# EAGLE design ECGv2_Board (EAGLE 6.5.0)
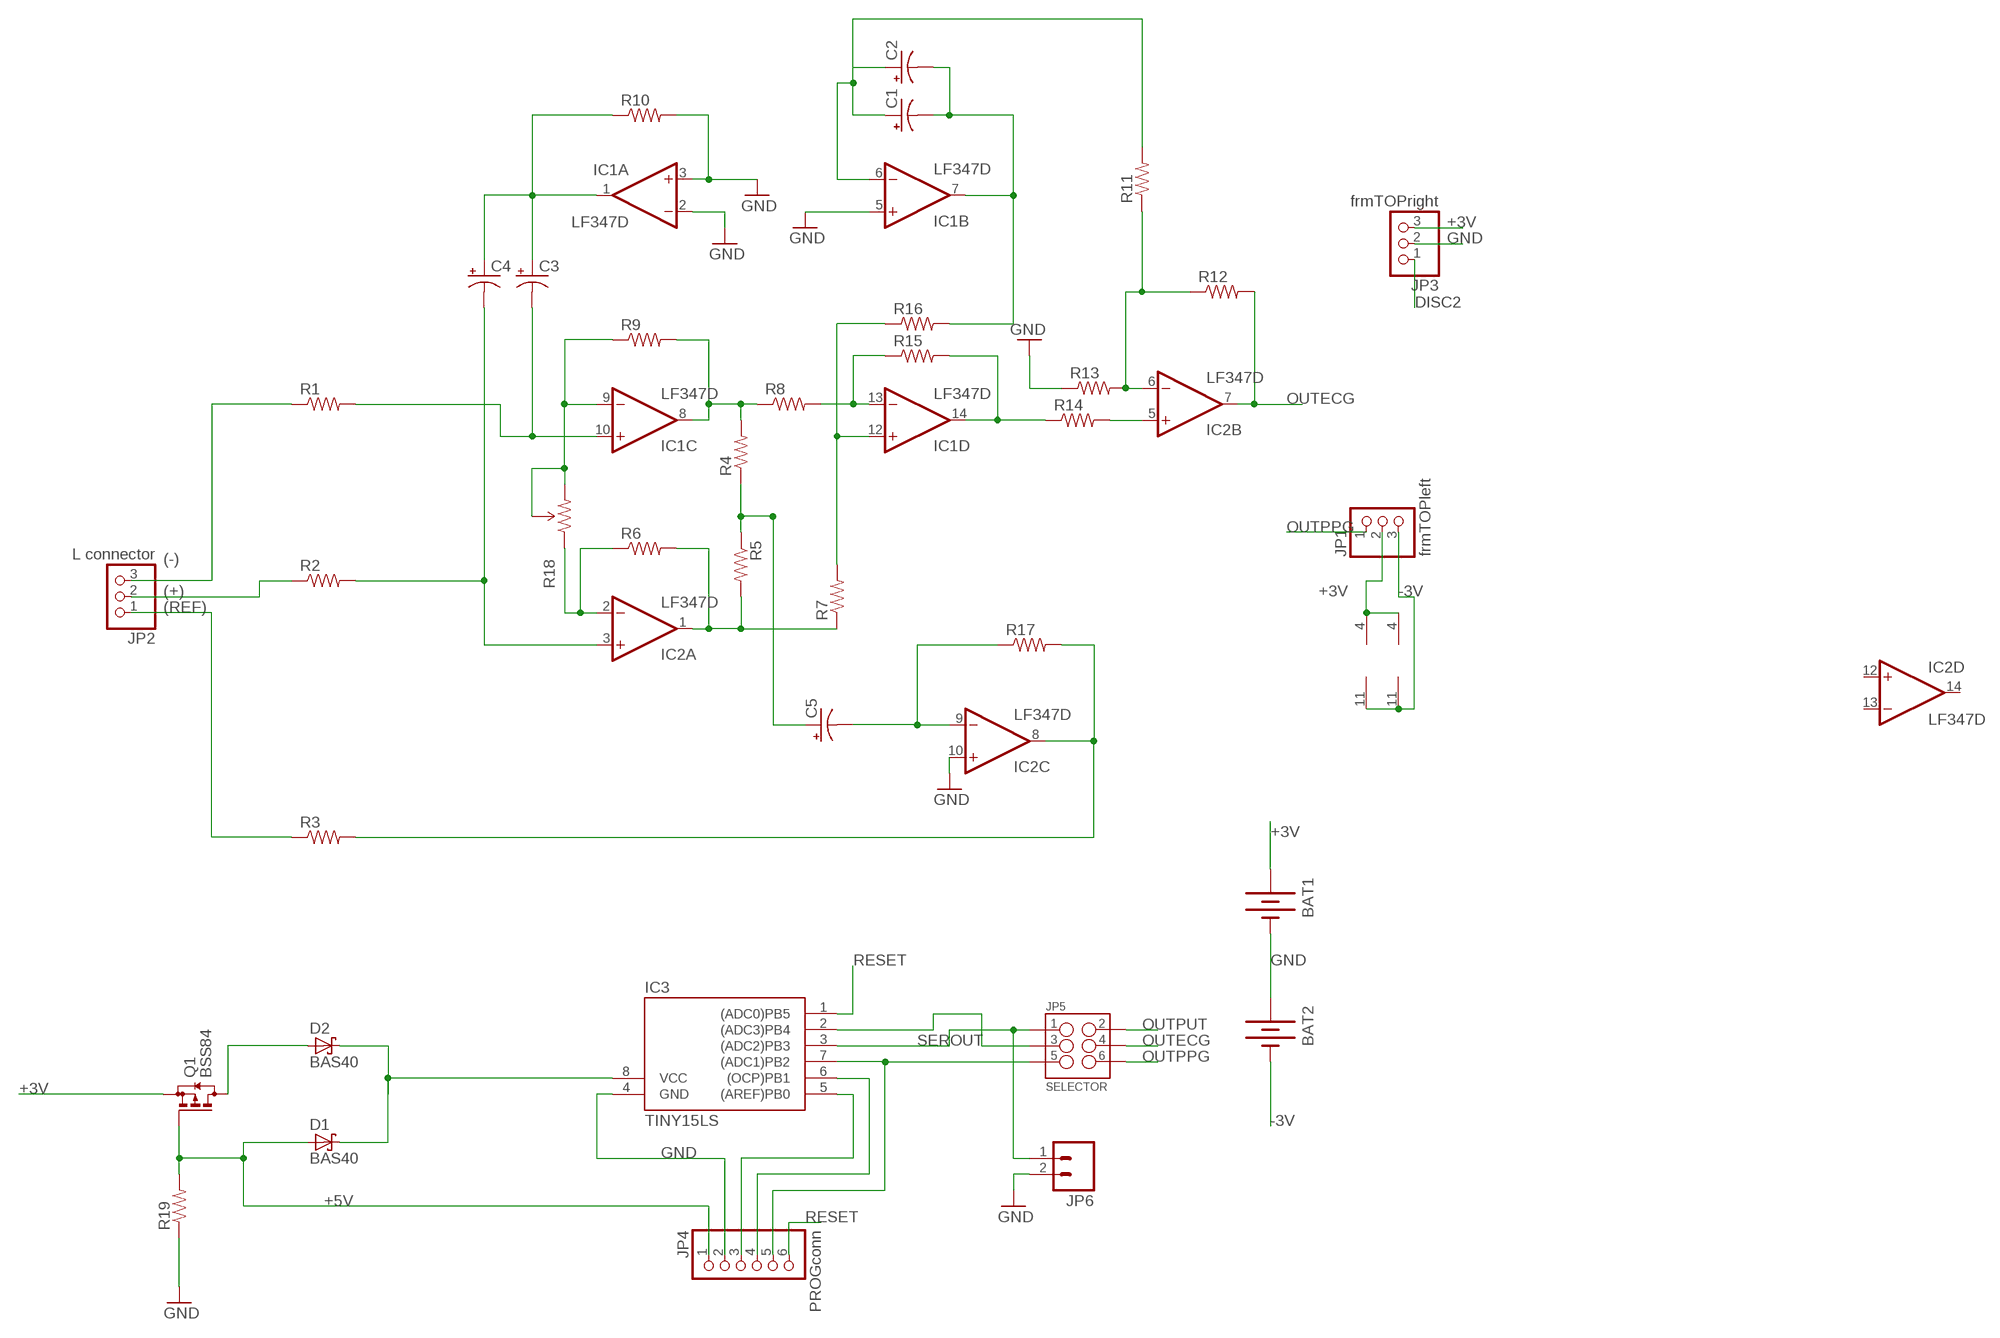
[diagram p0: schematic, sheet 1]

## Parts
BAT1  BATTERY245MM  [BATTCON_245MM]
BAT2  BATTERY245MM  [BATTCON_245MM]
C1  CAP_POL1206-KIT  [EIA3216-KIT]
C2  CAP_POL1206-KIT  [EIA3216-KIT]
C3  CAP_POL1206-KIT  [EIA3216-KIT]
C4  CAP_POL1206-KIT  [EIA3216-KIT]
C5  CAP_POL1206-KIT  [EIA3216-KIT]
D1  BAS40  [SOT23]
D2  BAS40  [SOT23]
IC1  LF347D  [SO14]
IC2  LF347D  [SO14]
IC3  TINY15LS  [SOIC8]
JP1  frmTOPleft  PINHD-1X3  [1X03]
JP2  L connector  PINHD-1X3  [1X03]
JP3  frmTOPright  PINHD-1X3  [1X03]
JP4  PROGconn  PINHD-1X6B  [1X06-BIG]
JP5  SELECTOR  M03X2FEMALE  [2X3]
JP6  M02PTH  [1X02]
Q1  BSS84  [SOT23]
R1  RESISTOR0402-RES  [0402-RES]
R2  RESISTOR0402-RES  [0402-RES]
R3  RESISTOR0402-RES  [0402-RES]
R4  RESISTOR0402-RES  [0402-RES]
R5  RESISTOR0402-RES  [0402-RES]
R6  RESISTOR0402-RES  [0402-RES]
R7  RESISTOR0402-RES  [0402-RES]
R8  RESISTOR0402-RES  [0402-RES]
R9  RESISTOR0402-RES  [0402-RES]
R10  RESISTOR0402-RES  [0402-RES]
R11  RESISTOR0402-RES  [0402-RES]
R12  RESISTOR0402-RES  [0402-RES]
R13  RESISTOR0402-RES  [0402-RES]
R14  RESISTOR0402-RES  [0402-RES]
R15  RESISTOR0402-RES  [0402-RES]
R16  RESISTOR0402-RES  [0402-RES]
R17  RESISTOR0402-RES  [0402-RES]
R18  TRIMPOT3362U-2  [3362U-2]
R19  RESISTOR0402-RES  [0402-RES]

## Nets
(+): JP2.2 R2.1
(-): JP2.3 R1.1
(REF): JP2.1 R3.1
+3V: BAT1.1(+) BAT1.3(+) IC1.4(P:V+) IC2.4(P:V+) JP1.2 JP3.3 Q1.2(S)
+5V: D1.1(A) JP4.1 Q1.1(G) R19.2
-3V: BAT2.2(-) IC1.11(P:V-) IC2.11(P:V-) JP1.3
DISC2: JP3.1
GND: BAT1.2(-) BAT2.1(+) BAT2.3(+) IC1.2(A:-IN) IC1.3(A:+IN) IC1.5(B:+IN) IC2.10(C:+IN) IC3.4(GND) JP3.2 JP4.2 JP6.2 R10.2 R13.1 R19.1
N$1: C1.C(-) C2.C(-) IC1.7(B:OUT) R16.2
N$2: C1.A(+) C2.A(+) IC1.6(B:-IN) R11.2
N$3: IC1.9(C:-IN) R9.1 R18.2(WIPER) R18.3(CW)
N$4: D2.1(A) Q1.3(D)
N$5: IC2.6(B:-IN) R11.1 R12.1 R13.2
N$6: IC1.14(D:OUT) R14.1 R15.2
N$7: IC1.13(D:-IN) R8.2 R15.1
N$8: IC1.12(D:+IN) R7.2 R16.1
N$9: IC2.1(A:OUT) R5.2 R6.2 R7.1
N$10: IC1.8(C:OUT) R4.2 R8.1 R9.2
N$12: IC2.2(A:-IN) R6.1 R18.1(CCW)
N$13: C5.A(+) R4.1 R5.1
N$14: C5.C(-) IC2.9(C:-IN) R17.1
N$15: IC2.8(C:OUT) R3.2 R17.2
N$16: C3.A(+) C4.A(+) IC1.1(A:OUT) R10.1
N$17: IC2.5(B:+IN) R14.2
N$18: C4.C(-) IC2.3(A:+IN) R2.2
N$19: C3.C(-) IC1.10(C:+IN) R1.2
N$23: IC3.5((AREF)PB0) JP4.3
N$24: IC3.6((OCP)PB1) JP4.4
N$25: IC3.7((ADC1)PB2) JP4.5 JP5.5
N$26: D1.3(C) D2.3(C) IC3.8(VCC)
N$28: IC3.2((ADC3)PB4) JP5.3
OUTECG: IC2.7(B:OUT) JP5.4 R12.2
OUTPPG: JP1.1 JP5.6
OUTPUT: JP5.2
RESET: IC3.1((ADC0)PB5) JP4.6
SEROUT: IC3.3((ADC2)PB3) JP5.1 JP6.1
Unconnected: IC2.12(D:+IN) IC2.13(D:-IN) IC2.14(D:OUT)

## Library data of the parts
BAT1 BAT2 = SparkFun-Electromechanical:BATTERY: Battery Holders Various common sizes : AA, AAA, 18650 (PRT-12895), 20mm coin cell and 12mm coin cell. 20MM_4LEGS, BATT-10373
C1-C5 = SparkFun-Passives:CAP_POL: Capacitor Polarized These are standard SMD and PTH capacitors. Normally 10uF, 47uF, and 100uF in electrolytic and tantalum varieties. Always verify the external diameter of the through hole cap, it varies with capacity, voltage, and manufacturer. The EIA devices should be standard.
D1 D2 = diode:BAS40: Silicon Schottky Diodes General-purpose diode for high-speed switching
IC1 IC2 = linear:LF347: OP AMP
IC3 = atmel:TINY15L: MICROCONTROLLER 2.7 V 1 Kbytes FLASH 64 bytes EEPROM 4-channel 10 bit ADC; OC_FARNELL: unknown; OC_NEWARK: unknown
JP1-JP3 = adafruit:PINHD-1X3: PIN HEADER
JP4 = adafruit:PINHD-1X6: PIN HEADER
JP5 = SparkFun-Connectors:M03X2: 2x3 .1" header. Shrouded, with keying- CONN-10681 SMT- CONN-11415 Pogo pins- HW-11044; PROD_ID: CONN-11566; VALUE: FEMALE 2x3
JP6 = SparkFun-Connectors:M02: Standard 2-pin 0.1" header. Use with - straight break away headers ( PRT-00116) - right angle break away headers (PRT-00553) - swiss pins (PRT-00743) - machine pins (PRT-00117) - female headers (PRT-00115) Molex polarized connector foot print use with: PRT-08233 with associated crimp pins and housings. 2.54_SCREWTERM for use with PRT-10571. 3.5mm Screw Terminal footprints for PRT-08084 5mm Screw Terminal footprints for use with PRT-08432
Q1 = transistor-small-signal:BSS84: P-CHANNEL MOS FET
R1-R17 R19 = SparkFun-Passives:RESISTOR: Resistor Basic schematic elements and footprints for 0603, 1206, and PTH resistors.
R18 = SparkFun-Electromechanical:TRIMPOT: Various small potentiometers for "set-and-forget" applications

## Board
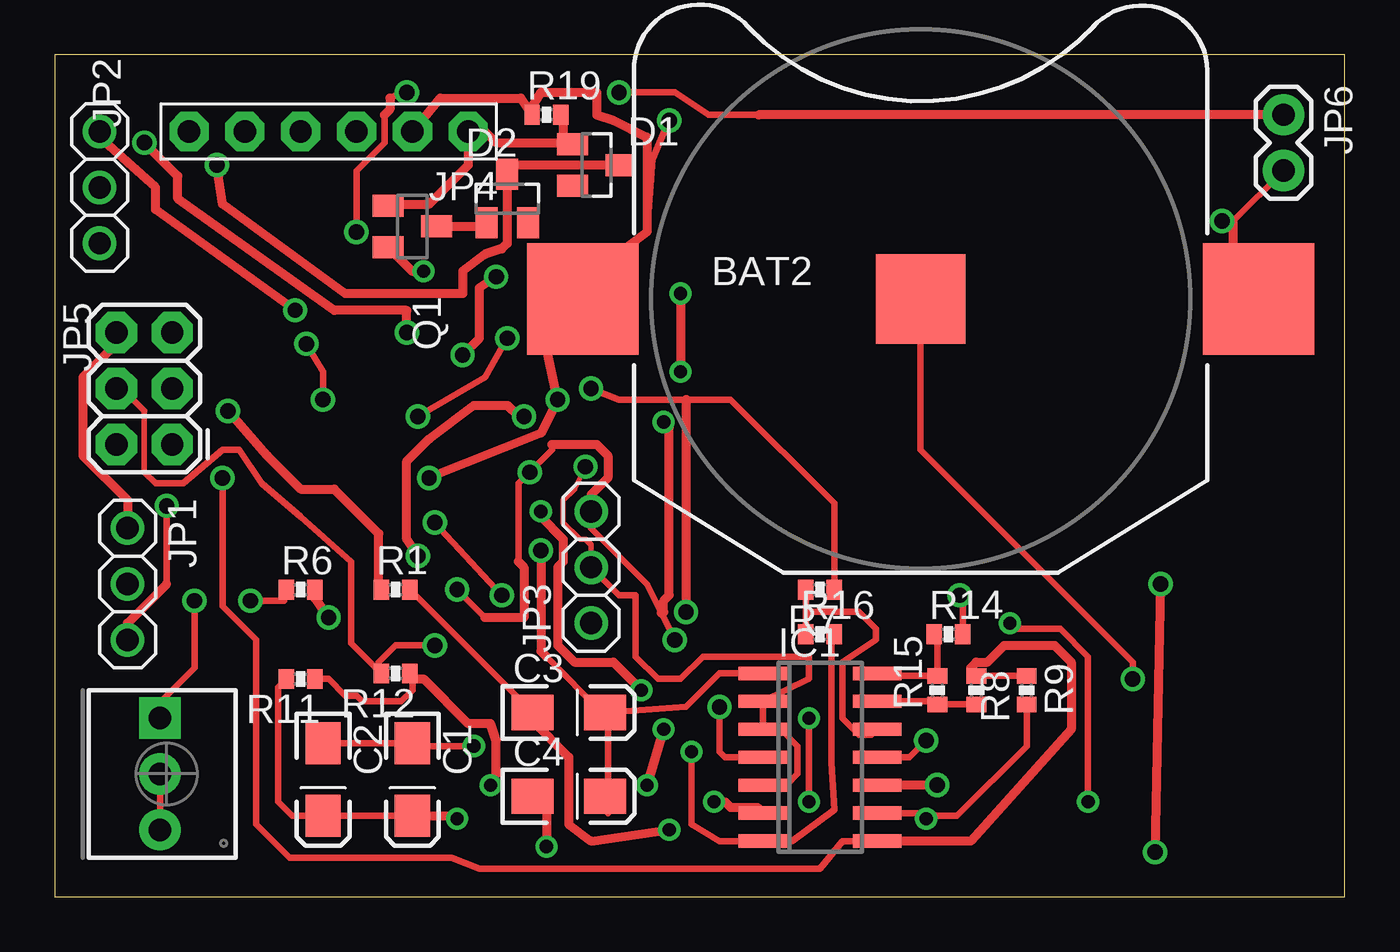
[diagram p1: board, top side]
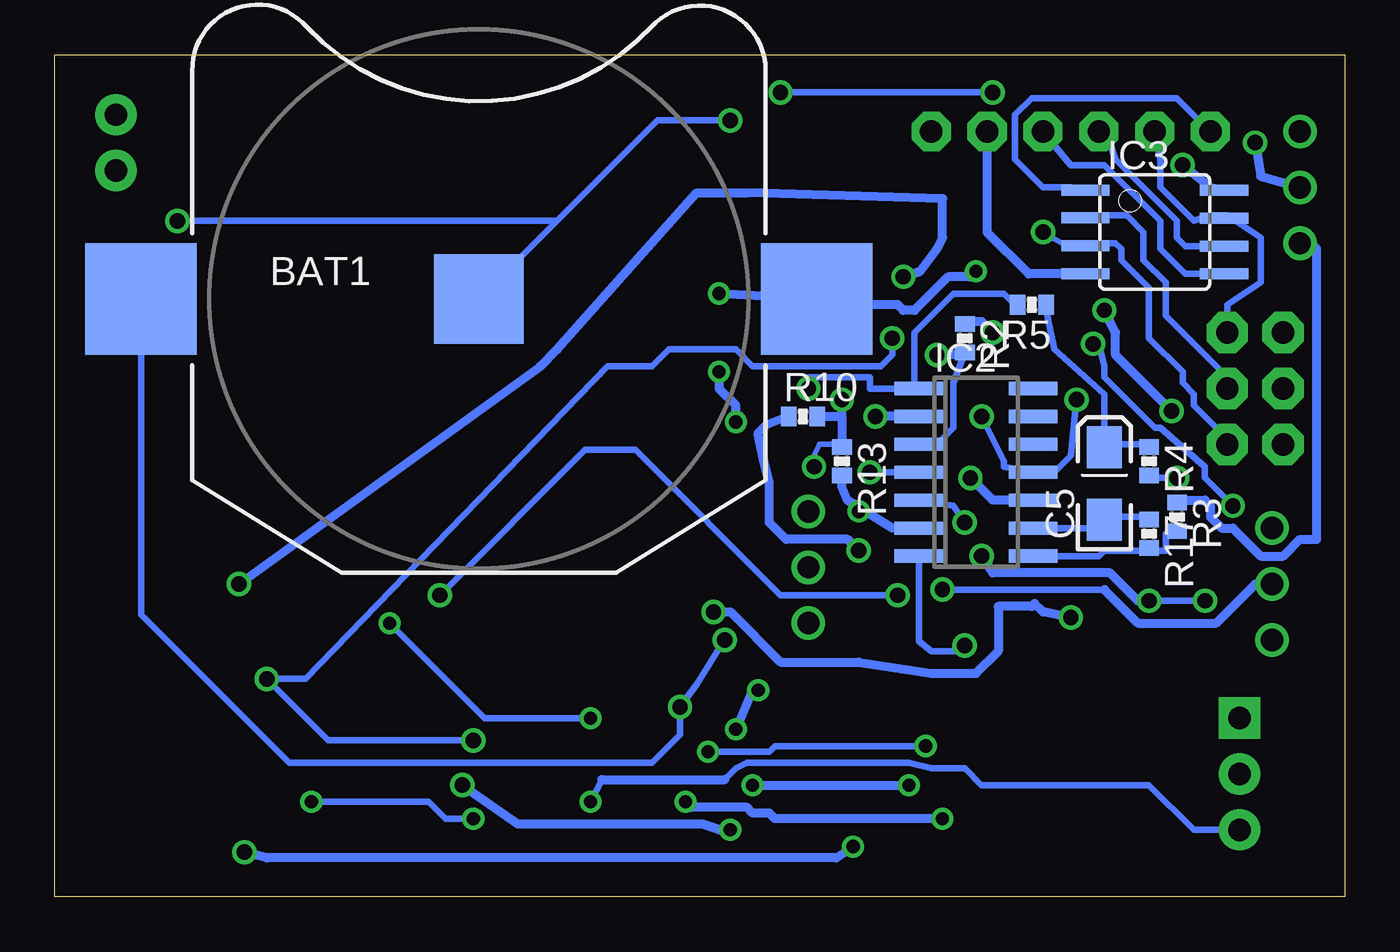
[diagram p2: board, bottom side, seen from below]

Size 58.65 x 38.28 mm. Coordinates in mm from the lower left corner, seen from the top.
Outline: 0,0 58.65,0 58.65,38.28 0,38.28 0,0
Copper layers (1*16): Top 0.035mm / dielectric 1.5mm / Bottom 0.035mm
Design rules "default *": minimum track width 10mil, minimum drill 20mil, track to track 8mil, track to pad 8mil, pad to pad 8mil, via to via 8mil, smd to smd 8mil, copper to edge 40mil, drill to drill 8mil, minimum pad ring 10mil, minimum via ring 8mil, stop-mask expansion 4mil, vias tented up to drill 0mil, thermal gap 10mil

### Footprints (pad centres in the part's own frame; a part is rotated, then mirrored left to right if it is on the bottom)
BATTCON_245MM = smd 5.08 x 5.08: 1 -15.367,0; 3 15.367,0 | smd 4.064 x 4.064: 2 0,0
EIA3216-KIT = smd 1.9 x 1.6: A 1.65,0; C -1.65,0
SOT23 = smd 1 x 1.4: 1 -0.95,-1.1; 2 0.95,-1.1; 3 0,1.1
SO14 = smd 0.6 x 2.2: 1 -3.81,-2.6; 2 -2.54,-2.6; 3 -1.27,-2.6; 4 0,-2.6; 5 1.27,-2.6; 6 2.54,-2.6; 7 3.81,-2.6; 8 3.81,2.6; 9 2.54,2.6; 10 1.27,2.6; 11 0,2.6; 12 -1.27,2.6; 13 -2.54,2.6; 14 -3.81,2.6
SOIC8 = smd 0.5 x 2.2: 1 -1.905,-3.154; 2 -0.645,-3.154; 3 0.625,-3.154; 4 1.895,-3.154; 5 1.905,3.154; 6 0.635,3.154; 7 -0.635,3.154; 8 -1.905,3.154
1X03 = drill 1.016: 1 -2.54,0; 2 0,0; 3 2.54,0
1X06-BIG = drill 1.016 pad 1.778 octagon: 1 -6.35,0; 2 -3.81,0; 3 -1.27,0; 4 1.27,0; 5 3.81,0; 6 6.35,0
2X3 = drill 1.016 pad 1.88 octagon: 1 0,0; 2 0,2.54; 3 2.54,0; 4 2.54,2.54; 5 5.08,0; 6 5.08,2.54
1X02 = drill 1.016 pad 1.88: 1 0,0; 2 2.54,0
0402-RES = smd 0.7 x 0.9: 1 -0.65,0; 2 0.65,0
3362U-2 = drill 1.016 pad 1.88 square: 1 -2.54,-0.305 | drill 1.016 pad 1.88: 2 0,-0.305; 3 2.54,-0.305

### Placement (x,y rotation side)
BAT1  39.37,27.18 0 bottom
BAT2  39.37,27.18 0 top
C1  16.26,5.33 270 top
C2  12.19,5.33 270 top
C3  23.37,8.38 0 top
C4  23.37,4.57 0 top
C5  10.92,18.8 90 bottom
D1  24.64,33.27 270 top
D2  20.57,31.75 0 top
IC1  34.8,6.35 270 top
IC2  16.76,19.3 270 bottom
IC3  8.64,30.23 270 bottom
JP1  3.3,14.22 270 top
JP2  2.03,32.26 90 top
JP3  24.38,14.99 90 top
JP4  12.45,34.8 180 top
JP5  5.33,20.57 90 top
JP6  55.88,35.56 270 top
Q1  16.26,30.48 270 top
R1  15.49,13.97 0 top
R2  17.27,25.4 270 bottom
R3  7.62,17.27 270 bottom
R4  8.89,19.81 270 bottom
R5  14.22,26.92 180 bottom
R6  11.18,13.97 0 top
R7  34.8,13.97 180 top
R8  41.91,9.4 270 top
R9  44.2,9.4 90 top
R10  24.64,21.84 0 bottom
R11  11.18,9.91 180 top
R12  15.49,10.16 180 top
R13  22.86,19.81 270 bottom
R14  40.64,11.94 0 top
R15  40.13,9.4 90 top
R16  34.8,11.94 0 top
R17  8.89,16.51 270 bottom
R18  5.08,5.59 270 top
R19  22.35,35.56 0 top

### Tracks (layer width: path | path; a pad name or v marks a point on that pad's centre or on a via)
(+)  (via drill 0.7 pad 0.81)
  Top 0.406: v4.06,34.29 5.59,32.77 5.59,31.75 12.7,26.67 16,26.67 v16,25.65
  Bottom 0.406: JP2.2 3.81,32.77 v4.06,34.29 | v16,25.65 16.51,26.16 17.27,26.16 R2.1
(-)  (via drill 0.7 pad 0.81)
  Top 0.406: R1.1 14.73,13.97 14.73,16.51 12.7,18.54 11.18,18.54 9.65,20.07 v7.87,22.1 | v10.92,26.67 4.57,31.24 4.57,32.26 2.03,34.54 JP2.3
  Bottom 0.406: v7.87,22.1 10.41,24.64 10.41,25.65 v10.92,26.67
(REF)
  Bottom 0.406: JP2.1 1.52,29.72 1.27,29.46 1.27,16.26 2.03,16.26 2.79,15.49 3.81,15.49 5.08,16.76 5.59,16.76 6.1,17.27 6.1,17.78 6.35,18.03 7.62,18.03 R3.1
+3V  (via drill 0.6, 0.7 pad 0.41, 0.7 pad 0.61)
  Top 0.305: JP3.3 24.38,16.76 26.92,14.22 27.58,12.9 v28.19,11.68 | v30.23,8.64 30.23,6.6 30.48,6.35 IC1.4 | 22.61,20.57 22.61,20.32 v21.59,19.3 21.08,18.8 21.08,15.24 | v18.29,13.97 19.56,12.7
  Top 0.406: 19.56,12.7 21.34,12.7 21.34,14.99 21.08,15.24 | JP3.3 24.38,18.29 25.15,19.05 25.15,20.07 24.64,20.57 22.61,20.57 | Q1.2 16.24,28.45 v16.76,28.45 | v28.45,27.43 v28.45,23.88 | v27.69,21.59 27.94,21.34 27.94,13.72 27.69,13.46 27.69,12.95 27.58,12.9
  Bottom 0.305: v28.19,11.68 29.46,9.65 v30.23,8.64 30.23,7.37 31.5,6.1 48.01,6.1 54.74,12.83 BAT1.1 | IC2.4 v21.59,19.3 | 10.92,13.97 v18.29,13.97
  Bottom 0.406: JP1.2 4.06,14.22 5.84,12.45 9.4,12.45 10.92,13.97 | v16.76,28.45 17.02,28.19 18.03,28.19 19.56,26.67 20.07,26.67 20.32,26.92 24,26.92 BAT1.3 v28.45,27.43 | v28.45,23.88 28.45,23.11 27.69,22.35 v27.69,21.59
+5V
  Top 0.406: Q1.1 15.24,31.5 17.02,31.5 18.8,33.27 JP4.1 19.56,34.8 20.07,34.29 23.47,34.29 D1.1 23.37,34.29 23.11,34.29 23.11,35.56 R19.2
-3V  (via drill 0.7 pad 0.41, 0.7 pad 0.61)
  Top 0.305: BAT2.2 39.37,20.32 49.02,10.67 v49.02,9.91 | IC1.11 38.86,6.35 v39.62,7.11 | v11.43,25.15 12.19,23.88 v12.19,22.61 | v20.57,25.4 19.56,23.62 v16.51,21.84 | v5.08,17.78 5.08,14.22
  Top 0.406: JP1.3 3.3,12.45 5.08,14.22
  Bottom 0.305: v39.62,7.11 46.23,7.11 v49.02,9.91 47.24,9.91 33.53,24.13 31.5,24.13 30.73,24.89 27.69,24.89 26.92,24.13 21.08,24.13 20.57,24.64 v20.57,25.4 | v11.43,25.15 11.18,25.15 10.92,24.13 10.92,23.62 8.64,21.34 8.38,21.34 6.35,19.56 6.35,19.05 v5.08,17.78 | v12.19,22.61 12.45,20.07 13.21,19.3 IC2.11 15.49,19.56 15.49,19.81 v16.51,21.84
GND  (via drill 0.7 pad 0.41, 0.7 pad 0.61, 0.7 pad 0.81)
  Top 0.254: v24.13,19.56 23.62,18.54 23.11,18.03 23.11,17.02 23.88,16.26 24.13,16.26 24.38,16 JP3.2
  Top 0.305: JP3.2 25.65,13.72 26.42,13.72 26.42,10.92 27.43,9.91 28.45,9.91 29.46,10.92 34.29,10.92 34.29,9.91 IC1.2 IC1.3 33.02,7.62 33.78,6.86 33.78,5.59 33.27,5.08 IC1.5 | 26.92,30.23 27.18,33.53 v27.94,35.31 | 53.59,30.73 JP6.2
  Top 0.406: JP4.2 17.53,36.32 21.19,36.32 R19.1 21.7,35.93 22.1,36.58 24.64,36.58 24.64,35.56 25.4,35.31 26.92,34.54 26.92,30.23 22.86,27.18 22.86,27.05 23.07,27.07 | 23.07,27.07 BAT2.1 | 23.07,27.07 22.1,26.1 v22.86,22.61 22.1,21.08 v17.02,19.05 | BAT2.3 53.85,27.18 53.59,27.43 53.59,30.73 v53.09,30.73
  Bottom 0.254: v24.13,19.56 24.38,19.56 23.88,20.57 22.61,20.57 R13.1
  Bottom 0.305: v27.94,35.31 31.24,35.31 35.81,30.73 | 35.81,30.73 BAT1.2 | 35.81,30.73 v53.09,30.73
  Bottom 0.406: R10.2 22.86,21.84 | 22.86,21.84 R13.1 | 22.86,21.84 v22.86,22.61 | IC2.10 16,18.03 v17.02,19.05 | JP4.2 16.26,30.23 14.36,28.33 IC3.4
N$1  (via drill 0.6 pad 0.41)
  Top 0.305: R16.2 35.31,11.94 35.31,6.1 35.45,3.95 33.53,2.54 IC1.7 30.23,2.54 28.96,3.3 v28.96,6.6 | C2.C C1.C 16.38,6.86 v19.05,6.86
  Bottom 0.305: v28.96,6.6 26.16,6.6 25.91,6.86 v19.05,6.86
N$2  (via drill 0.6)
  Top 0.305: C1.A C2.A 10.79,3.68 10.16,4.32 10.16,9.54 R11.2
  Top 0.406: C1.A 18.16,3.68 v18.29,3.56 | v29.97,4.32 30.48,4.32 30.73,4.06 31.94,4.06 IC1.6
  Bottom 0.406: v18.29,3.56 25.91,3.56 26.16,3.81 26.92,3.81 27.18,4.06 29.72,4.06 v29.97,4.32
N$3  (via drill 0.6 pad 0.41)
  Top 0.305: v46.99,4.32 46.99,10.92 45.72,12.19 43.43,12.19 v43.43,12.45 | v34.29,4.32 v34.29,8.13 | IC1.9 39.37,3.81 v39.62,3.56 39.75,3.68 41.02,3.68 44.2,6.86 R9.1 | R18.3 R18.2
  Bottom 0.305: v46.99,4.32 41.66,4.32 40.89,3.56 v39.62,3.56 | v43.43,12.45 39.12,8.13 v34.29,8.13 | 33.78,5.33 v34.29,4.32 | 28.19,5.33 27.69,5.84 27.18,6.1 19.81,6.1 18.8,5.84 17.27,5.84 16.51,5.08 8.89,5.08 6.86,3.05 R18.3
  Bottom 0.406: 33.78,5.33 28.19,5.33
N$4
  Top 0.406: Q1.3 19.45,30.48 D2.1
N$5  (via drill 0.6, 0.6 pad 0.41)
  Top 0.305: R11.1 12.45,9.91 13.21,9.14 13.72,9.14 13.97,8.89 15.75,8.89 16.26,9.4 16.26,9.79 R12.1
  Top 0.406: R12.1 16.26,9.91 16.76,9.91 18.8,7.87 19.81,7.87 20.07,7.11 20.07,5.59 v19.81,5.08 | v27.69,7.62 v26.92,5.08 | v26.67,9.4 25.4,10.67 23.62,10.67 22.86,11.43 22.86,14.99 23.11,15.24 23.11,16.26 22.1,17.27 v22.1,17.53
  Bottom 0.406: IC2.6 20.57,16.76 22.01,17.66 | 22.01,17.66 22.61,18.03 22.86,18.65 R13.2 | v26.92,5.08 v19.81,5.08 | v27.69,7.62 26.92,9.4 v26.67,9.4 | v22.1,17.53 22.01,17.66
N$6
  Top 0.305: IC1.14 37.51,10.05 R15.2 40.13,11.8 R14.1
N$7
  Top 0.305: IC1.13 39.99,8.89 R15.1 R8.2
N$8
  Top 0.305: R7.2 R16.1 34.15,12.81 34.29,12.95 36.58,12.95 37.34,12.19 37.34,11.68 35.81,10.67 35.81,8.13 36.58,7.37 37.14,7.37 IC1.12
N$9  (via drill 0.7 pad 0.61, 0.7 pad 0.81)
  Top 0.305: R7.1 35.45,17.89 30.73,22.61 28.7,22.61 25.65,22.61 v24.38,23.11
  Top 0.406: R6.2 11.83,13.57 v12.45,12.7 | 28.7,22.61 v28.7,12.95
  Bottom 0.305: R5.2 14.99,26.92 15.49,27.43 17.78,27.43 19.56,25.65 19.56,23.31 IC2.1 21.59,23.11 21.59,23.62 24.38,23.62 v24.38,23.11
  Bottom 0.406: v12.45,12.7 13.72,12.95 14.1,13.34 14.22,13.21 15.75,13.21 15.75,11.18 16.76,10.16 18.8,10.16 22.1,10.67 25.65,10.67 27.94,12.95 v28.7,12.95
N$10  (via drill 0.7 pad 0.61)
  Top 0.305: R9.2 R8.1 41.66,10.41 | IC1.8 35.81,2.54 34.8,1.27 19.3,1.27 18.03,1.78 10.67,1.78 9.14,3.3 9.14,11.68 7.62,13.21 v7.62,19.05
  Top 0.406: R8.1 41.91,10.16 41.66,10.41 41.91,10.67 42.42,10.67 43.18,11.43 45.47,11.43 46.23,10.67 46.23,7.62 41.66,2.54 IC1.8
  Bottom 0.305: v7.62,19.05 8.89,19.05 R4.2
N$12  (via drill 0.7 pad 0.61, 0.7 pad 0.81)
  Top 0.305: v6.35,13.46 6.35,10.41 4.83,8.89 4.83,8.13 R18.1 | v8.89,13.46 10.41,13.46 10.41,13.97 R6.1
  Top 0.406: v16.51,15.49 16,16.26 16,19.81 17.02,20.83 19.05,22.35 20.57,22.35 21.08,21.84 v21.34,21.84
  Bottom 0.305: v6.35,13.46 v8.89,13.46
  Bottom 0.406: v16.51,15.49 16,14.73 10.67,14.73 9.4,13.46 v8.89,13.46 | IC2.2 v21.34,21.84
N$13
  Bottom 0.305: 10.92,20.57 8.89,20.57 R4.1 | 10.92,20.57 10.92,22.86 13.21,24.89 13.46,26.16 R5.1 | 10.92,20.57 C5.A
N$14
  Bottom 0.305: R17.1 8.89,17.27 11.18,17.27 C5.C 11.18,16.76 IC2.9
N$15
  Bottom 0.305: 8.89,15.75 8.13,15.75 8.13,16.51 7.62,16.51 R3.2 | 8.89,15.75 10.92,15.75 11.18,15.49 IC2.8 | 8.89,15.75 R17.2
N$16  (via drill 0.7 pad 0.81)
  Top 0.305: C4.A 25.15,3.81 25.15,7.87 C3.A | C3.A 28.7,8.64 30.23,10.16 IC1.1 | C3.A 24.89,8.38 22.35,10.92
  Top 0.406: v22.1,15.75 22.1,11.18 22.35,10.92
  Bottom 0.406: R10.1 26.3,21.45 26.67,21.08 26.42,19.81 26.16,18.8 26.16,17.02 25.4,16.26 22.61,16.26 v22.1,15.75
N$17  (via drill 0.7 pad 0.61)
  Top 0.305: R14.2 41.29,13.57 v41.15,13.72 | v17.27,17.02 v20.32,13.72
  Bottom 0.305: v41.15,13.72 34.54,20.32 32.26,20.32 25.65,13.72 v20.32,13.72 | v17.27,17.02 17.78,17.78 IC2.5
N$18  (via drill 0.6 pad 0.41, 0.7 pad 0.81)
  Top 0.406: v20.07,28.19 19.3,27.69 19.3,25.4 v18.54,24.64 | v50.04,2.03 v50.29,14.22 | v22.35,2.29 22.35,4.57 C4.C
  Bottom 0.305: R2.2 17.78,23.37 17.78,21.34 18.54,20.57 IC2.3
  Bottom 0.406: v20.07,28.19 19.3,28.45 18.54,29.46 18.29,29.97 18.29,31.75 27.18,32 29.46,32 35.81,24.89 36.58,24.13 v50.29,14.22 | v18.54,24.64 17.27,24.64 R2.2 | v50.04,2.03 49.02,1.78 23.11,1.78 v22.35,2.29
N$19  (via drill 0.6 pad 0.41, 0.7 pad 0.41)
  Top 0.305: C3.C R1.2
  Top 0.406: C3.C 21.72,8 23.37,6.35 23.37,3.3 24.38,2.54 v27.94,3.05 | v40.13,5.08 IC1.10
  Bottom 0.406: v27.94,3.05 28.45,3.05 29.21,3.3 37.59,3.3 v40.13,5.08
N$23
  Bottom 0.305: IC3.5 7.24,28.32 8.38,29.46 8.38,30.73 10.92,33.27 12.45,33.27 JP4.3
N$24
  Bottom 0.305: IC3.6 7.24,29.59 7.62,29.97 7.62,30.73 10.41,33.53 10.67,34.29 JP4.4
N$25
  Bottom 0.305: JP4.5 8.38,33.53 8.38,32.26 6.86,30.73 6.12,30.99 | 6.12,30.99 IC3.7 | JP5.5 5.33,26.92 3.81,27.94 3.81,29.97 5.33,30.99 6.12,30.99
N$26  (via drill 0.7 pad 0.81)
  Top 0.406: v7.37,33.27 7.62,31.5 13.21,27.43 18.54,27.43 18.54,28.45 19.56,29.21 20.32,29.46 20.57,29.72 D2.3 20.57,33.27 D1.3
  Bottom 0.406: 6.1,32.26 6.35,32.26 | v7.37,33.27 6.1,32.26 | 6.1,32.26 IC3.8
N$28
  Bottom 0.305: JP5.3 5.33,23.62 8.13,26.42 8.13,27.94 9.14,28.96 9.14,30.23 9.91,30.99 12.18,30.99 IC3.2
OUTECG  (via drill 0.7 pad 0.61)
  Top 0.254: 4.06,22.1 4.06,19.3
  Top 0.305: v17.27,11.43 15.49,11.43 14.73,10.67 14.73,10.27 R12.2 13.46,11.54 13.46,15.24 11.18,17.27 9.4,18.8 8.38,20.32 7.62,20.32 5.84,18.8 4.57,18.8 4.06,19.3 | JP5.4 3.05,23.11 4.06,22.1
  Bottom 0.305: IC2.7 19.36,11.62 18.8,11.18 17.53,11.18 v17.27,11.43
OUTPPG
  Top 0.406: JP1.1 3.3,18.03 1.27,20.07 1.27,23.62 2.79,25.15 JP5.6
RESET
  Bottom 0.305: JP4.6 7.62,36.32 14.22,36.32 14.99,35.56 14.99,33.53 13.72,32.26 12.43,32.26 IC3.1
SEROUT  (via drill 0.7 pad 0.41)
  Top 0.305: v13.72,30.23 13.72,33.02 14.99,34.29 14.99,35.56 | 32,35.56 29.72,35.56 28.19,36.58 v25.65,36.58 | v16,36.58 15.75,36.58 15.24,36.32
  Top 0.406: JP6.1 32,35.56 | 15.24,36.32 15.24,35.81 14.99,35.56
  Bottom 0.254: v13.72,30.23 12.42,29.46 IC3.3
  Bottom 0.305: JP5.1 5.33,20.83 6.86,22.35 6.86,22.86 7.37,23.37 7.37,23.88 8.89,25.4 8.89,27.69 10.16,28.96 10.16,29.46 10.41,29.72 12.18,29.72 IC3.3 | v25.65,36.58 v16,36.58